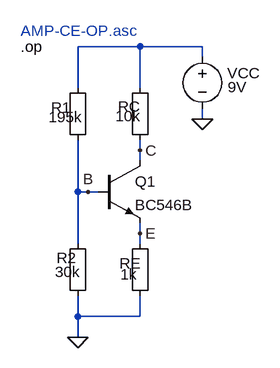
[diagram p0: schematic AMP-CE-OP.asc]
AMP-CE-OP.asc, the LTspice schematic file:
Version 4
SHEET 1 880 680
WIRE 192 -64 96 -64
WIRE 288 -64 192 -64
WIRE 288 -48 288 -64
WIRE 96 0 96 -64
WIRE 192 0 192 -64
WIRE 288 48 288 32
WIRE 192 96 192 80
WIRE 192 112 192 96
WIRE 96 160 96 80
WIRE 112 160 96 160
WIRE 128 160 112 160
WIRE 192 224 192 208
WIRE 96 240 96 160
WIRE 192 240 192 224
WIRE 96 352 96 320
WIRE 192 352 192 320
WIRE 192 352 96 352
WIRE 96 384 96 352
FLAG 288 48 0
FLAG 96 384 0
FLAG 112 160 B
FLAG 192 96 C
FLAG 192 224 E
SYMBOL npn 128 112 R0
SYMATTR InstName Q1
SYMATTR Value BC546B
SYMBOL Misc\\EuropeanResistor 80 -16 R0
WINDOW 0 -25 46 Left 2
WINDOW 3 -29 61 Left 2
SYMATTR InstName R1
SYMATTR Value 195k
SYMBOL Misc\\EuropeanResistor 176 -16 R0
WINDOW 0 -18 45 Left 2
WINDOW 3 -22 59 Left 2
SYMATTR InstName RC
SYMATTR Value 10k
SYMBOL voltage 288 -64 R0
WINDOW 0 38 41 Left 2
WINDOW 3 39 63 Left 2
WINDOW 123 0 0 Left 2
WINDOW 39 0 0 Left 2
SYMATTR InstName VCC
SYMATTR Value 9V
SYMBOL Misc\\EuropeanResistor 176 224 R0
WINDOW 0 -16 46 Left 2
WINDOW 3 -14 63 Left 2
SYMATTR InstName RE
SYMATTR Value 1k
SYMBOL Misc\\EuropeanResistor 80 224 R0
WINDOW 0 -17 38 Left 2
WINDOW 3 -19 59 Left 2
SYMATTR InstName R2
SYMATTR Value 30k
TEXT 8 -64 Left 2 !.op
TEXT 8 -88 Left 2 ;AMP-CE-OP.asc

The netlist it stands for:
* AMP-CE-OP.asc
Q1 C B E 0 BC546B
R1 N001 B 195k
RC N001 C 10k
VCC N001 0 9V
RE E 0 1k
R2 B 0 30k
.model NPN NPN
.model PNP PNP
.lib standard.bjt
.op
* AMP-CE-OP.asc
.backanno
.end